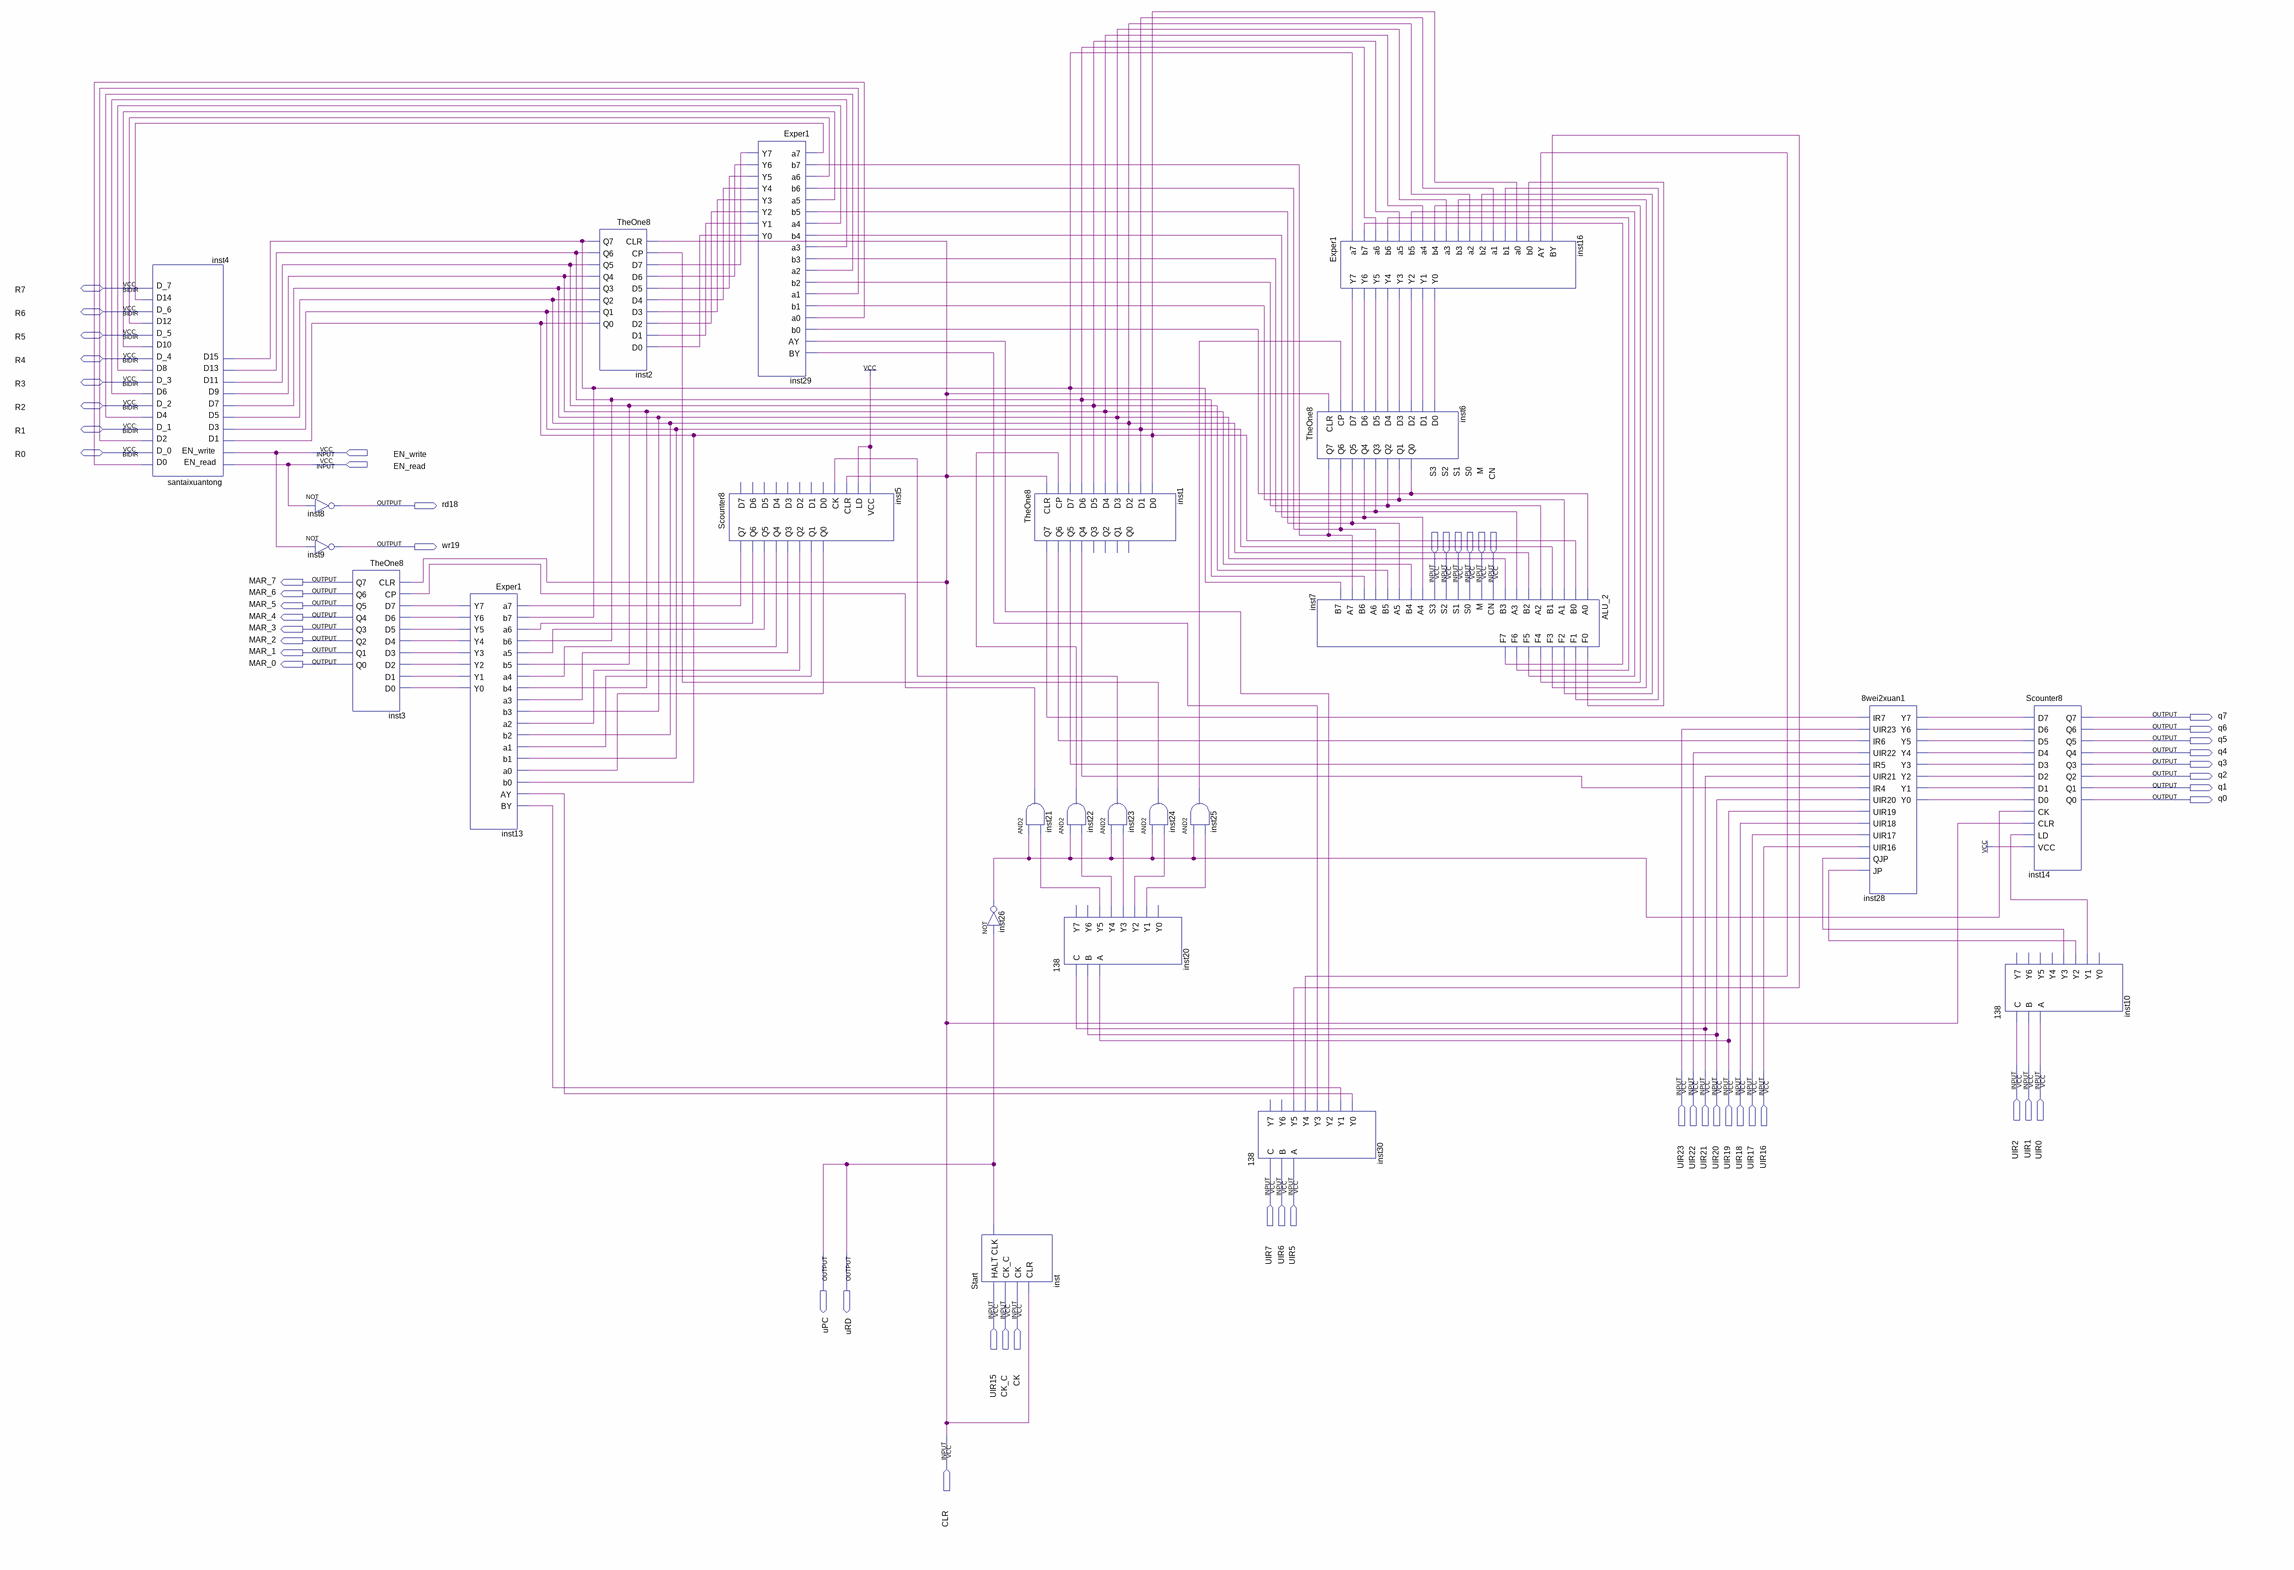
[diagram p0: schematic sheet]
// Quartus schematic zhengji.bdf as structural Verilog: 24 symbols, 54 pins
module zhengji (
  input  EN_write,
  input  EN_read,
  input  S3,
  input  S2,
  input  S1,
  input  S0,
  input  M,
  input  CN,
  input  UIR2,
  input  UIR1,
  input  UIR0,
  input  UIR23,
  input  UIR22,
  input  UIR21,
  input  UIR20,
  input  UIR19,
  input  UIR18,
  input  UIR17,
  input  UIR16,
  input  UIR7,
  input  UIR6,
  input  UIR5,
  input  UIR15,
  input  CK_C,
  input  CK,
  input  CLR,
  inout  R7,
  inout  R6,
  inout  R5,
  inout  R4,
  inout  R3,
  inout  R2,
  inout  R1,
  inout  R0,
  output rd18,
  output wr19,
  output MAR_7,
  output MAR_6,
  output MAR_5,
  output MAR_4,
  output MAR_3,
  output MAR_2,
  output MAR_1,
  output MAR_0,
  output q7,
  output q6,
  output q5,
  output q4,
  output q3,
  output q2,
  output q1,
  output q0,
  output uPC,
  output uRD
);

  wire inst1_q4, inst1_q5, inst1_q6, inst1_q7, inst2_q0, inst2_q1, inst2_q2, inst2_q3, inst2_q4, inst2_q5,
       inst2_q6, inst2_q7, inst4_d0, inst4_d2, inst4_d4, inst4_d6, inst4_d8, inst4_d10, inst4_d12, inst4_d14,
       inst5_q0, inst5_q1, inst5_q2, inst5_q3, inst5_q4, inst5_q5, inst5_q6, inst5_q7, inst6_q0, inst6_q1,
       inst6_q2, inst6_q3, inst6_q4, inst6_q5, inst6_q6, inst6_q7, inst7_f0, inst7_f1, inst7_f2, inst7_f3,
       inst7_f4, inst7_f5, inst7_f6, inst7_f7, inst10_y1, inst10_y2, inst10_y3, inst13_y0, inst13_y1,
       inst13_y2, inst13_y3, inst13_y4, inst13_y5, inst13_y6, inst13_y7, inst16_y0, inst16_y1, inst16_y2,
       inst16_y3, inst16_y4, inst16_y5, inst16_y6, inst16_y7, inst20_y1, inst20_y2, inst20_y3, inst20_y4,
       inst20_y5, inst21_out, inst22_out, inst23_out, inst24_out, inst25_out, inst26_out, inst28_y0,
       inst28_y1, inst28_y2, inst28_y3, inst28_y4, inst28_y5, inst28_y6, inst28_y7, inst29_y0, inst29_y1,
       inst29_y2, inst29_y3, inst29_y4, inst29_y5, inst29_y6, inst29_y7, inst30_y0, inst30_y1, inst30_y2,
       inst30_y3, inst30_y4, inst30_y5;

  santaixuantong inst4 (
    .EN_read(EN_read), .EN_write(EN_write), .D1(inst2_q0), .D3(inst2_q1), .D5(inst2_q2), .D7(inst2_q3),
    .D9(inst2_q4), .D11(inst2_q5), .D13(inst2_q6), .D15(inst2_q7), .D0(inst4_d0), .D2(inst4_d2),
    .D4(inst4_d4), .D6(inst4_d6), .D8(inst4_d8), .D10(inst4_d10), .D12(inst4_d12), .D14(inst4_d14), .D_0(R0),
    .D_1(R1), .D_2(R2), .D_3(R3), .D_4(R4), .D_5(R5), .D_6(R6), .D_7(R7));
  not inst8 (rd18, EN_read);
  not inst9 (wr19, EN_write);
  TheOne8 inst3 (
    .CLR(CLR), .CP(inst21_out), .D7(inst13_y7), .D6(inst13_y6), .D5(inst13_y5), .D4(inst13_y4),
    .D3(inst13_y3), .D2(inst13_y2), .D1(inst13_y1), .D0(inst13_y0), .Q7(MAR_7), .Q6(MAR_6), .Q5(MAR_5),
    .Q4(MAR_4), .Q3(MAR_3), .Q2(MAR_2), .Q1(MAR_1), .Q0(MAR_0));
  Exper1 inst13 (
    .a7(inst5_q7), .b7(inst2_q7), .a6(inst5_q6), .b6(inst2_q6), .a5(inst5_q5), .b5(inst2_q5), .a4(inst5_q4),
    .b4(inst2_q4), .a3(inst5_q3), .b3(inst2_q3), .a2(inst5_q2), .b2(inst2_q2), .a1(inst5_q1), .b1(inst2_q1),
    .a0(inst5_q0), .b0(inst2_q0), .AY(inst30_y0), .BY(inst30_y1), .Y7(inst13_y7), .Y6(inst13_y6),
    .Y5(inst13_y5), .Y4(inst13_y4), .Y3(inst13_y3), .Y2(inst13_y2), .Y1(inst13_y1), .Y0(inst13_y0));
  TheOne8 inst2 (
    .CLR(CLR), .CP(inst24_out), .D7(inst29_y7), .D6(inst29_y6), .D5(inst29_y5), .D4(inst29_y4),
    .D3(inst29_y3), .D2(inst29_y2), .D1(inst29_y1), .D0(inst29_y0), .Q7(inst2_q7), .Q6(inst2_q6),
    .Q5(inst2_q5), .Q4(inst2_q4), .Q3(inst2_q3), .Q2(inst2_q2), .Q1(inst2_q1), .Q0(inst2_q0));
  Exper1 inst29 (
    .a7(inst4_d14), .b7(inst6_q7), .a6(inst4_d12), .b6(inst6_q6), .a5(inst4_d10), .b5(inst6_q5),
    .a4(inst4_d8), .b4(inst6_q4), .a3(inst4_d6), .b3(inst6_q3), .a2(inst4_d4), .b2(inst6_q2), .a1(inst4_d2),
    .b1(inst6_q1), .a0(inst4_d0), .b0(inst6_q0), .AY(inst30_y2), .BY(inst30_y3), .Y7(inst29_y7),
    .Y6(inst29_y6), .Y5(inst29_y5), .Y4(inst29_y4), .Y3(inst29_y3), .Y2(inst29_y2), .Y1(inst29_y1),
    .Y0(inst29_y0));
  Scounter8 inst5 (
    .CK(inst23_out), .CLR(CLR), .LD(1'b1), .VCC(1'b1), .Q7(inst5_q7), .Q6(inst5_q6), .Q5(inst5_q5),
    .Q4(inst5_q4), .Q3(inst5_q3), .Q2(inst5_q2), .Q1(inst5_q1), .Q0(inst5_q0));  // open: D7, D6, D5, D4, D3, D2, D1, D0
  not inst26 (inst26_out, uPC);
  Start inst (.HALT(UIR15), .CK_C(CK_C), .CK(CK), .CLR(CLR), .CLK(uPC));
  TheOne8 inst1 (
    .CLR(CLR), .CP(inst22_out), .D7(inst2_q7), .D6(inst2_q6), .D5(inst2_q5), .D4(inst2_q4), .D3(inst2_q3),
    .D2(inst2_q2), .D1(inst2_q1), .D0(inst2_q0), .Q7(inst1_q7), .Q6(inst1_q6), .Q5(inst1_q5), .Q4(inst1_q4));  // open: Q3, Q2, Q1, Q0
  and inst21 (inst21_out, inst26_out, inst20_y5);
  and inst22 (inst22_out, inst26_out, inst20_y4);
  \138  inst20 (
    .C(UIR21), .B(UIR20), .A(UIR19), .Y5(inst20_y5), .Y4(inst20_y4), .Y3(inst20_y3), .Y2(inst20_y2),
    .Y1(inst20_y1));  // open: Y7, Y6, Y0
  and inst23 (inst23_out, inst26_out, inst20_y3);
  and inst24 (inst24_out, inst26_out, inst20_y2);
  and inst25 (inst25_out, inst26_out, inst20_y1);
  \138  inst30 (
    .C(UIR7), .B(UIR6), .A(UIR5), .Y5(inst30_y5), .Y4(inst30_y4), .Y3(inst30_y3), .Y2(inst30_y2),
    .Y1(inst30_y1), .Y0(inst30_y0));  // open: Y7, Y6
  TheOne8 inst6 (
    .CLR(CLR), .CP(inst25_out), .D7(inst16_y7), .D6(inst16_y6), .D5(inst16_y5), .D4(inst16_y4),
    .D3(inst16_y3), .D2(inst16_y2), .D1(inst16_y1), .D0(inst16_y0), .Q7(inst6_q7), .Q6(inst6_q6),
    .Q5(inst6_q5), .Q4(inst6_q4), .Q3(inst6_q3), .Q2(inst6_q2), .Q1(inst6_q1), .Q0(inst6_q0));
  ALU_2 inst7 (
    .A0(inst6_q0), .B0(inst2_q0), .A1(inst6_q1), .B1(inst2_q1), .A2(inst6_q2), .B2(inst2_q2), .A3(inst6_q3),
    .B3(inst2_q3), .CN(CN), .M(M), .S0(S0), .S1(S1), .S2(S2), .S3(S3), .A4(inst6_q4), .B4(inst2_q4),
    .A5(inst6_q5), .B5(inst2_q5), .A6(inst6_q6), .B6(inst2_q6), .A7(inst6_q7), .B7(inst2_q7), .F0(inst7_f0),
    .F1(inst7_f1), .F2(inst7_f2), .F3(inst7_f3), .F4(inst7_f4), .F5(inst7_f5), .F6(inst7_f6), .F7(inst7_f7));
  Exper1 inst16 (
    .a7(inst2_q7), .b7(inst7_f7), .a6(inst2_q6), .b6(inst7_f6), .a5(inst2_q5), .b5(inst7_f5), .a4(inst2_q4),
    .b4(inst7_f4), .a3(inst2_q3), .b3(inst7_f3), .a2(inst2_q2), .b2(inst7_f2), .a1(inst2_q1), .b1(inst7_f1),
    .a0(inst2_q0), .b0(inst7_f0), .AY(inst30_y4), .BY(inst30_y5), .Y7(inst16_y7), .Y6(inst16_y6),
    .Y5(inst16_y5), .Y4(inst16_y4), .Y3(inst16_y3), .Y2(inst16_y2), .Y1(inst16_y1), .Y0(inst16_y0));
  \8wei2xuan1  inst28 (
    .IR7(inst1_q7), .UIR23(UIR23), .IR6(inst1_q6), .UIR22(UIR22), .IR5(inst1_q5), .UIR21(UIR21),
    .IR4(inst1_q4), .UIR20(UIR20), .UIR19(UIR19), .UIR18(UIR18), .UIR17(UIR17), .UIR16(UIR16),
    .QJP(inst10_y3), .JP(inst10_y2), .Y7(inst28_y7), .Y6(inst28_y6), .Y5(inst28_y5), .Y4(inst28_y4),
    .Y3(inst28_y3), .Y2(inst28_y2), .Y1(inst28_y1), .Y0(inst28_y0));
  Scounter8 inst14 (
    .D7(inst28_y7), .D6(inst28_y6), .D5(inst28_y5), .D4(inst28_y4), .D3(inst28_y3), .D2(inst28_y2),
    .D1(inst28_y1), .D0(inst28_y0), .CK(inst26_out), .CLR(CLR), .LD(inst10_y1), .VCC(1'b1), .Q7(q7), .Q6(q6),
    .Q5(q5), .Q4(q4), .Q3(q3), .Q2(q2), .Q1(q1), .Q0(q0));
  \138  inst10 (
    .C(UIR2), .B(UIR1), .A(UIR0), .Y3(inst10_y3), .Y2(inst10_y2), .Y1(inst10_y1));  // open: Y7, Y6, Y5, Y4, Y0

  assign uRD = uPC;
endmodule
